# Altium schematic sheet PA_PShifter_R00.SchDoc
size A4; SheetNumber: 2; SheetTotal: 2
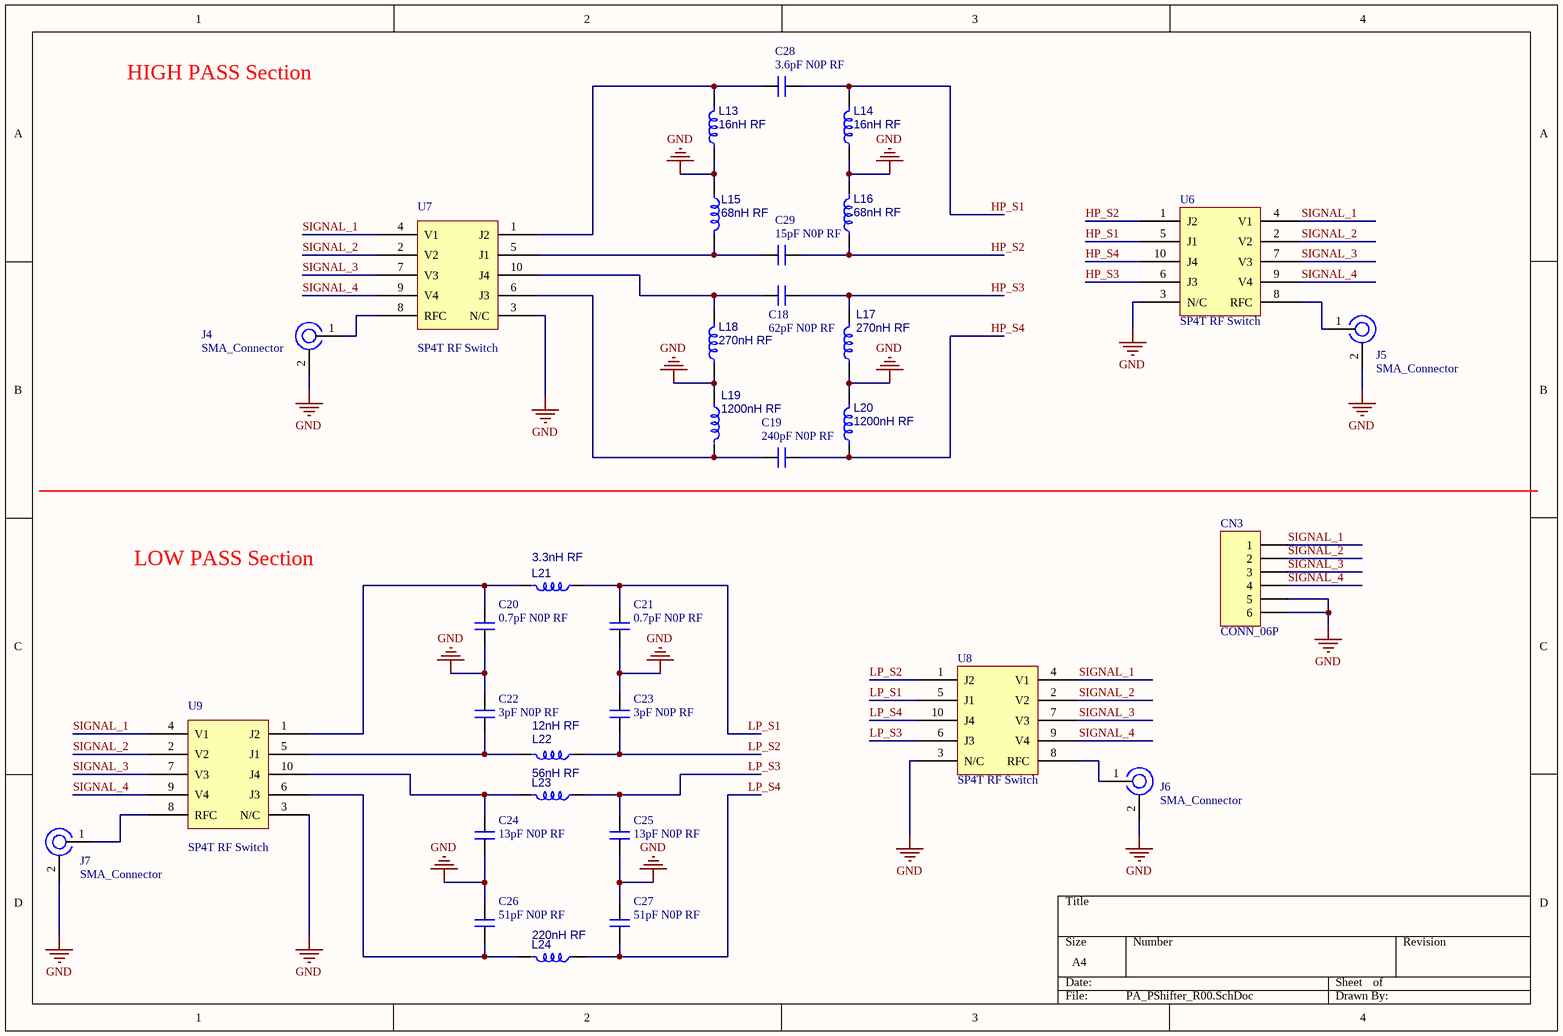
[diagram p0: PA_PShifter_R00.SchDoc]

## Parts
C18  62pF N0P RF  [C_0603]
C19  240pF N0P RF  [C_0603]
C20  0.7pF N0P RF  [C_0603]
C21  0.7pF N0P RF  [C_0603]
C22  3pF N0P RF  [C_0603]
C23  3pF N0P RF  [C_0603]
C24  13pF N0P RF  [C_0603]
C25  13pF N0P RF  [C_0603]
C26  51pF N0P RF  [C_0603]
C27  51pF N0P RF  [C_0603]
C28  3.6pF N0P RF  [C_0603]
C29  15pF N0P RF  [C_0603]
CN3  CONN_06P  [Header_M_2x3_0.1"]
J4  SMA_Connector  [SMA_Connector]
J5  SMA_Connector  [SMA_Connector]
J6  SMA_Connector  [SMA_Connector]
J7  SMA_Connector  [SMA_Connector]
L13  16nH RF  [L_0603]
L14  16nH RF  [L_0603]
L15  68nH RF  [L_0603]
L16  68nH RF  [L_0603]
L17  270nH RF  [L_0603]
L18  270nH RF  [L_0603]
L19  1200nH RF  [L_0805]
L20  1200nH RF  [L_0805]
L21  3.3nH RF  [L_0603]
L22  12nH RF  [L_0603]
L23  56nH RF  [L_0603]
L24  220nH RF  [L_0603]
U6  SP4T RF Switch  [SP4T Switch RF]
U7  SP4T RF Switch  [SP4T Switch RF]
U8  SP4T RF Switch  [SP4T Switch RF]
U9  SP4T RF Switch  [SP4T Switch RF]

## Nets
GND: C20.1 C21.1 C22.2 C23.2 C24.1 C25.1 C26.2 C27.2 CN3.5 CN3.6 J4.2 J5.2 J6.2 J7.2 L13.1 L14.1 L15.1 L16.2 L17.1 L18.1 L19.1 L20.2 U6.3(N/C) U7.3(N/C) U8.3(N/C) U9.3(N/C)
HP_S1: C28.2 L14.2 U6.5(J1)
HP_S2: C29.2 L16.1 U6.1(J2)
HP_S3: C18.2 L17.2 U6.6(J3)
HP_S4: C19.2 L20.1 U6.10(J4)
LP_S1: C21.2 L21.1 U8.5(J1)
LP_S2: C23.1 L22.1 U8.1(J2)
LP_S3: C25.2 L23.1 U8.6(J3)
LP_S4: C27.1 L24.1 U8.10(J4)
SIGNAL_1: CN3.1 U6.4(V1) U7.4(V1) U8.4(V1) U9.4(V1)
SIGNAL_2: CN3.2 U6.2(V2) U7.2(V2) U8.2(V2) U9.2(V2)
SIGNAL_3: CN3.3 U6.7(V3) U7.7(V3) U8.7(V3) U9.7(V3)
SIGNAL_4: CN3.4 U6.9(V4) U7.9(V4) U8.9(V4) U9.9(V4)
NetC18_1: C18.1 L18.2 U7.10(J4)
NetC19_1: C19.1 L19.2 U7.6(J3)
NetC20_2: C20.2 L21.2 U9.1(J2)
NetC22_1: C22.1 L22.2 U9.5(J1)
NetC24_2: C24.2 L23.2 U9.10(J4)
NetC26_1: C26.1 L24.2 U9.6(J3)
NetC28_1: C28.1 L13.2 U7.1(J2)
NetC29_1: C29.1 L15.2 U7.5(J1)
NetJ4_1: J4.1 U7.8(RFC)
NetJ5_1: J5.1 U6.8(RFC)
NetJ6_1: J6.1 U8.8(RFC)
NetJ7_1: J7.1 U9.8(RFC)

## Notes on the sheet
- HIGH PASS Section
- LOW PASS Section

## Library data of the parts
C18-C29 = Ceramic Cap
CN3 = CONN_06P: Connector Generic 4 Vias
J4-J7 = SMA_Connector: Connector SMA
L13-L24 = Inductor Chip: CHIP inductor
U6-U9 = SP4T RF Switch: SKY13322-375LF